# EAGLE design xbee_sdi12 (EAGLE 5.06)
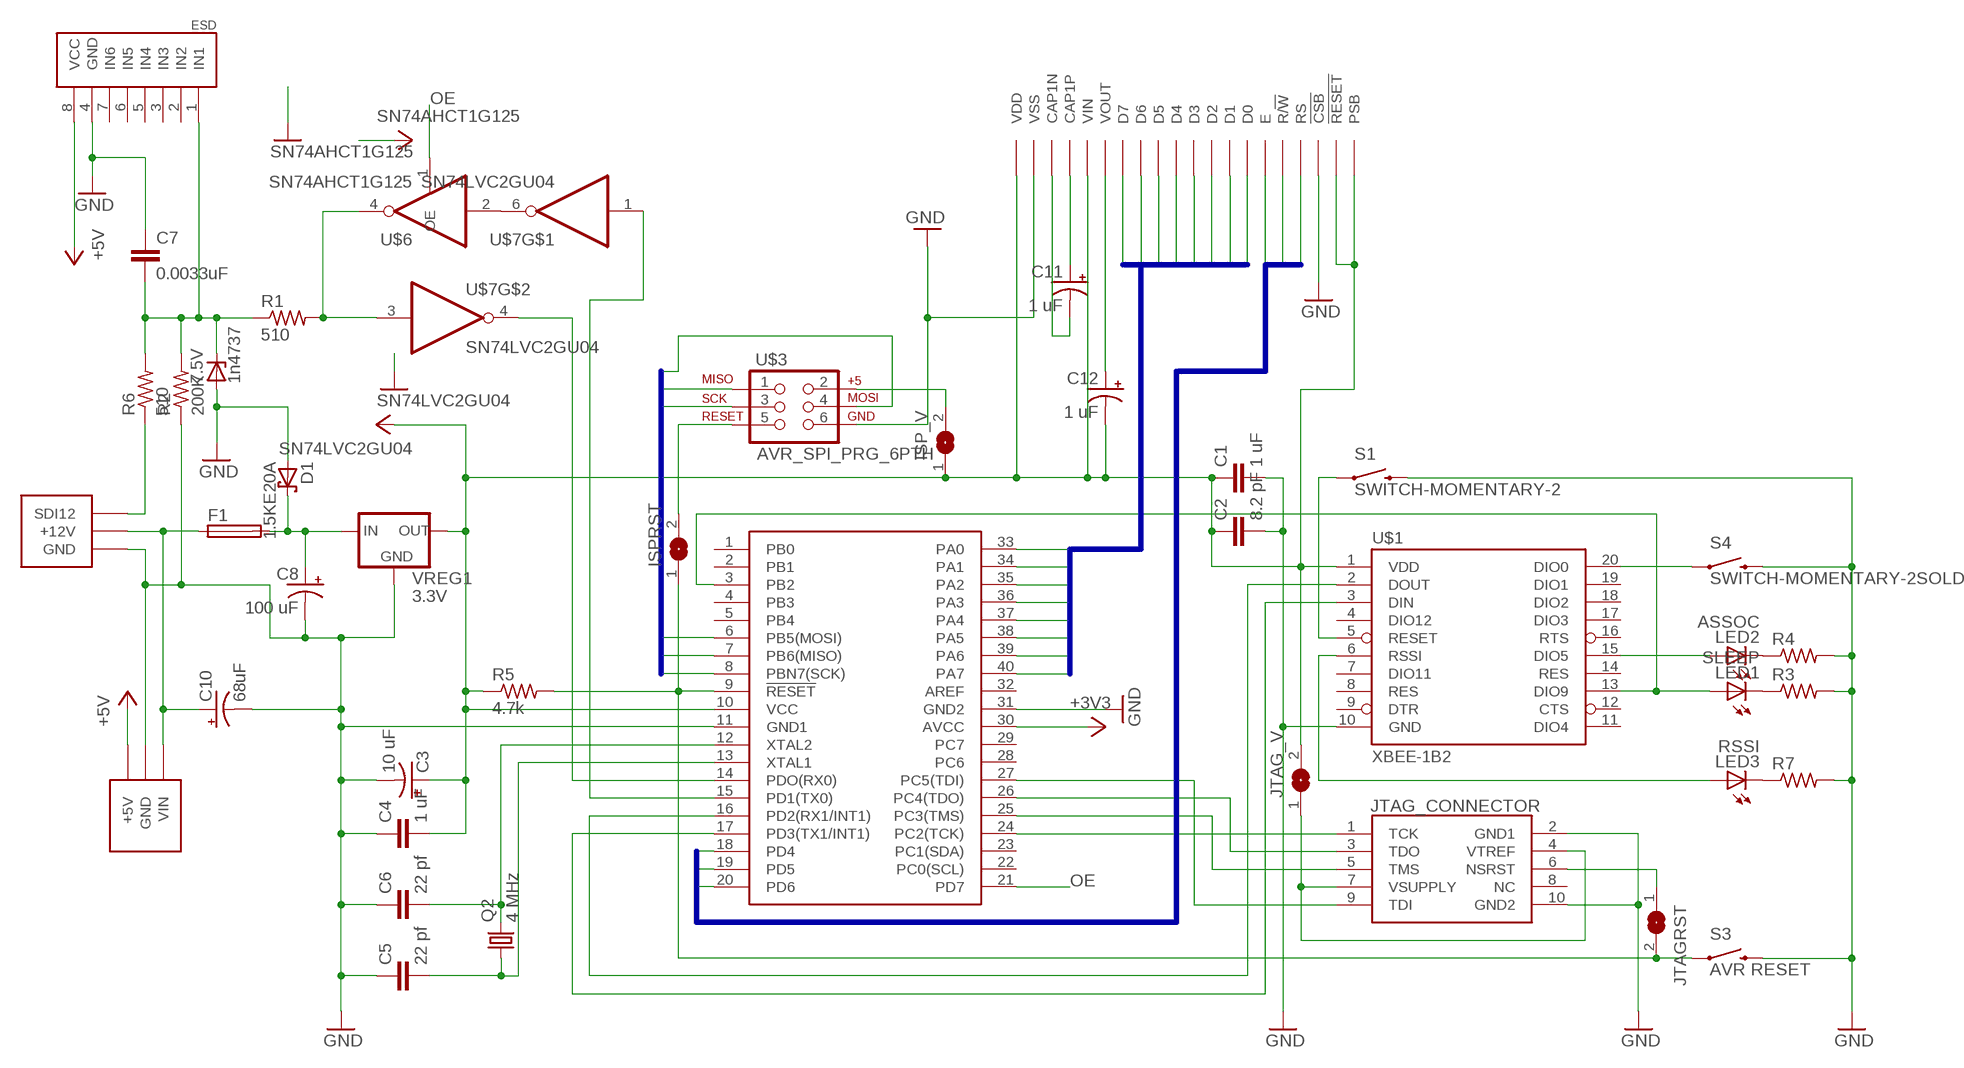
[diagram p0: schematic, sheet 1]

## Parts
2,5  SDI12  [SDI12]
7.5V  1n4737  1N4728  [DO41Z10]
C1  1 uF  CAPPTH  [CAP-PTH-SMALL]
C2  8.2 pF  CAPPTH  [CAP-PTH-SMALL]
C3  10 uF  CAP_POLPTH2  [CPOL-RADIAL-10UF-25V]
C4  1 uF  CAPPTH  [CAP-PTH-SMALL]
C5  22 pf  CAPPTH  [CAP-PTH-SMALL]
C6  22 pf  CAPPTH  [CAP-PTH-SMALL]
C7  0.0033uF  CAPPTH  [CAP-PTH-SMALL]
C8  100 uF  CAP_POLPTH2  [CPOL-RADIAL-10UF-25V]
C10  68uF  CPOL-USE3.5-8  [E3,5-8]
C11  1 uF  CAP_POLPTH2  [CPOL-RADIAL-10UF-25V]
C12  1 uF  CAP_POLPTH2  [CPOL-RADIAL-10UF-25V]
D1  1.5KE20A  15KEXXD  [DO201T15]
ESD  SP721  [DIL08]
F1  19560  [19560]
ISP_V  SJ  [SJ]
ISPRST  SJ  [SJ]
JTAG_CONNECTOR  JTAG_CONNECTOR  [2X5-SHROUDED]
JTAG_V  SJ  [SJ]
JTAGRST  SJ  [SJ]
LED1  SLEEP  LED3MM  [LED3MM]
LED2  ASSOC  LED3MM  [LED3MM]
LED3  RSSI  LED3MM  [LED3MM]
Q2  4 MHz  CRYSTALHC49US  [HC49US]
R1  510  R-US_0309/10  [0309/10]
R2  200K  R-US_0309/10  [0309/10]
R3  R-US_0309/10  [0309/10]
R4  R-US_0309/10  [0309/10]
R5  4.7k  R-US_0309/10  [0309/10]
R6  510  R-US_0309/10  [0309/10]
R7  R-US_0309/10  [0309/10]
S1  SWITCH-MOMENTARY-2  [TACTILE-PTH-RA]
S3  AVR RESET  SWITCH-MOMENTARY-2  [TACTILE-PTH-RA]
S4  SWITCH-MOMENTARY-2SOLDER  [1X02]
U$1  XBEE-1B2  [XBEE-SILK]
U$2  ATMEGA644  [DIL40]
U$3  AVR_SPI_PRG_6PTH  [2X3]
U$4  LCD  EA_LCD  [SIL40]
U$6  SN74AHCT1G125  [SOT23-5]
U$7  SN74LVC2GU04  [DBV_R-PDSO-G6]
U$8  V_REG  [TO-92]
VREG1  3.3V  3.3V_VREGNOSILKSCREEN  [TO220-PADS]

## Nets
+3V3: C1.1 C2.1 C3.1(+) C4.2 C12.2(-) ISP_V.1 JTAG_V.2 R5.1 U$1.1(VDD) U$2.10(VCC) U$2.30(AVCC) U$4.P$23(PSB) U$4.P$25(VIN) U$4.P$26(VDD) U$4.P$40(!RESET) U$7.5(+3V3) VREG1.2(OUT)
+5V: ESD.8(VCC) U$6.5(+5V) U$8.1(+5V)
GND: 2,5.GND 7.5V.A C1.2 C2.2 C3.2(-) C4.1 C5.1 C6.1 C7.1 C8.2(-) C10.- D1.A ESD.4(GND) JTAG_CONNECTOR.2(GND1) JTAG_CONNECTOR.10(GND2) R2.1 R3.2 R4.2 R7.2 S1.4 S3.4 S4.2 U$1.10(GND) U$2.11(GND1) U$2.31(GND2) U$3.6 U$4.P$27(VSS) U$4.P$38(!CSB) U$6.3(GND) U$7.2(GND) U$8.2(GND) VREG1.1(GND)
MISO: U$2.7(PB6(MISO)) U$3.1
MOSI: U$2.6(PB5(MOSI)) U$3.4
N$1: 2,5.SDI12 R6.1
N$2: C5.2 Q2.1 U$2.13(XTAL1)
N$3: U$2.15(PD1(TX0)) U$7.1(I)
N$4: JTAG_CONNECTOR.6(NSRST) JTAGRST.1
N$5: U$1.3(DIN) U$2.17(PD3(TX1/INT1))
N$6: U$1.2(DOUT) U$2.16(PD2(RX1/INT1))
N$7: U$2.14(PDO(RX0)) U$7.4(O)
N$8: C11.1(+) U$4.P$22(CAP1P)
N$9: 7.5V.C C7.2 ESD.1(IN1) R1.1 R2.2 R6.2
N$10: C6.2 Q2.2 U$2.12(XTAL2)
N$11: JTAG_CONNECTOR.1(TCK) U$2.24(PC2(TCK))
N$12: JTAG_CONNECTOR.3(TDO) U$2.26(PC4(TDO))
N$13: JTAG_CONNECTOR.5(TMS) U$2.25(PC3(TMS))
N$14: JTAG_CONNECTOR.9(TDI) U$2.27(PC5(TDI))
N$15: ISPRST.2 U$3.5
N$17: LED3.K(C) R7.1
N$18: LED1.K(C) R3.1
N$19: ISPRST.1 JTAGRST.2 R5.2 S3.3 U$2.9(!RESET)
N$20: LED1.A U$1.13(DIO9) U$2.3(PB2)
N$21: R1.2 U$6.4(O) U$7.3(I)
N$22: LED2.K(C) R4.1
N$23: LED2.A U$1.15(DIO5)
N$24: U$6.2(I) U$7.6(O)
N$25: S1.3 U$1.5(RESET)
N$26: LED3.A U$1.6(RSSI)
N$27: S4.1 U$1.20(DIO0)
N$28: C11.2(-) U$4.P$21(CAP1N)
N$29: C12.1(+) U$4.P$24(VOUT)
N$33: 2,5.12V(+12V) C10.+ F1.1 U$8.3(VIN)
N$34: JTAG_CONNECTOR.4(VTREF) JTAG_CONNECTOR.7(VSUPPLY) JTAG_V.1
N$35: ISP_V.2 U$3.2
N$36: C8.1(+) D1.C F1.2 VREG1.3(IN)
OE: U$2.21(PD7) U$6.1(OE)
PA0: U$2.33(PA0) U$4.P$35(D0)
PA1: U$2.34(PA1) U$4.P$34(D1)
PA2: U$2.35(PA2) U$4.P$33(D2)
PA3: U$2.36(PA3) U$4.P$32(D3)
PA4: U$2.37(PA4) U$4.P$31(D4)
PA5: U$2.38(PA5) U$4.P$30(D5)
PA6: U$2.39(PA6) U$4.P$29(D6)
PA7: U$2.40(PA7) U$4.P$28(D7)
PD4: U$2.18(PD4) U$4.P$36(E)
PD5: U$2.19(PD5) U$4.P$37(R/!W)
PD6: U$2.20(PD6) U$4.P$39(RS)
SCK: U$2.8(PBN7(SCK)) U$3.3
Unconnected: ESD.2(IN2) ESD.3(IN3) ESD.5(IN4) ESD.6(IN5) ESD.7(IN6) JTAG_CONNECTOR.8(NC) U$1.4(DIO12) U$1.7(DIO11) U$1.8(RES) U$1.9(DTR) U$1.11(DIO4) U$1.12(CTS) U$1.14(RES) U$1.16(RTS) U$1.17(DIO3) U$1.18(DIO2) U$1.19(DIO1) U$2.1(PB0) U$2.2(PB1) U$2.4(PB3) U$2.5(PB4) U$2.22(PC0(SCL)) U$2.23(PC1(SDA)) U$2.28(PC6) U$2.29(PC7) U$2.32(AREF)

## Buses
MOSI,MISO,SCK
PA[0..7]
PD[4..6]

## Library data of the parts
2,5 = jeff2:SDI12
7.5V = diode:1N4728: Z DIODE 3.3 V, 1W, 5 percent
C1 C2 C4-C7 = SparkFun:CAP: Capacitor Standard 0603 ceramic capacitor, and 0.1" leaded capacitor.
C3 C8 C11 C12 = SparkFun:CAP_POL: Capacitor Polarized These are standard SMD and PTH capacitors. Normally 10uF, 47uF, and 100uF in electrolytic and tantalum varieties. Always verify the external diameter of the through hole cap, it varies with capacity, voltage, and manufacturer. The EIA devices should be standard.
C10 = resistor:CPOL-US: POLARIZED CAPACITOR, American symbol
D1 = diode:15KEXXD: DIODE
ESD = jeff2:SP721
F1 = fuse:19560: FUSE HOLDER TR5, Wickmann
ISP_V ISPRST JTAG_V JTAGRST = jumper:SJ: SMD solder JUMPER
JTAG_CONNECTOR = jeff:JTAG_CONNECTOR
LED1-LED3 = led:LED: LED OSRAM: - CHIPLED LG R971, LG N971, LY N971, LG Q971, LY Q971, LO R971, LY R971 LH N974, LH R974 LS Q976, LO Q976, LY Q976 LO Q996 - Hyper CHIPLED LW Q18S LB Q993, LB Q99A, LB R99A - SideLED LS A670, LO A670, LY A670, LG A670, LP A670 LB A673, LV A673, LT A673, LW A673 LH A674 LY A675 LS A676, LA A676, LO A676, LY A676, LW A676 LS A679, LY A679, LG A679 - Hyper Micro SIDELED® LS Y876, LA Y876, LO Y876, LY Y876 LT Y87S - SmartLED LW L88C, LW L88S LB L89C, LB L89S, LG L890 LS L89K, LO L89K, LY L89K LS L896, LA L896, LO L896, LY L896 - TOPLED LS T670, LO T670, LY T670, LG T670, LP T670 LSG T670, LSP T670, LSY T670, LOP T670, LYG T670 LG T671, LOG T671, LSG T671 LB T673, LV T673, LT T673, LW T673 LH T674 LS T676, LA T676, LO T676, LY T676, LB T676, LH T676, LSB T676, LW T676 LB T67C, LV T67C, LT T67C, LS T67K, LO T67K, LY T67K, LW E67C LS E67B, LA E67B, LO E67B, LY E67B, LB E67C, LV E67C, LT E67C LW T67C LS T679, LY T679, LG T679 LS T770, LO T770, LY T770, LG T770, LP T770 LB T773, LV T773, LT T773, LW T773 LH T774 LS E675, LA E675, LY E675, LS T675 LS T776, LA T776, LO T776, LY T776, LB T776 LHGB T686 LT T68C, LB T68C - Hyper Mini TOPLED® LB M676 - Mini TOPLED Santana® LG M470 LS M47K, LO M47K, LY M47K Source: http://www.osram.convergy.de LUXEON: - LUMILED® LXK2-PW12-R00, LXK2-PW12-S00, LXK2-PW14-U00, LXK2-PW14-V00 LXK2-PM12-R00, LXK2-PM12-S00, LXK2-PM14-U00 LXK2-PE12-Q00, LXK2-PE12-R00, LXK2-PE12-S00, LXK2-PE14-T00, LXK2-PE14-U00 LXK2-PB12-K00, LXK2-PB12-L00, LXK2-PB12-M00, LXK2-PB14-N00, LXK2-PB14-P00, LXK2-PB14-Q00 LXK2-PR12-L00, LXK2-PR12-M00, LXK2-PR14-Q00, LXK2-PR14-R00 LXK2-PD12-Q00, LXK2-PD12-R00, LXK2-PD12-S00 LXK2-PH12-R00, LXK2-PH12-S00 LXK2-PL12-P00, LXK2-PL12-Q00, LXK2-PL12-R00 Source: www.luxeon.com KINGBRIGHT: KA-3528ASYC Source: www.kingbright.com
Q2 = SparkFun:CRYSTAL: Crystals Various standard crystals. Proven footprints. Spark Fun Electronics SKU : COM-00534
R1-R7 = resistor:R-US_: RESISTOR, American symbol
S1 S3 S4 = jeff2:SWITCH-MOMENTARY-2
U$1 = SparkFun:XBEE-1
U$2 = jeff:ATMEGA644
U$3 = SparkFun:AVR_SPI_PRG_6: AVR ISP 6 Pin This is the reduced ISP connector for AVR programming. Common on Arduino. This footprint will take up less PCB space and can be used with a 10-pin to 6-pin adapter such as SKU: BOB-08508
U$4 = jeff2:EA_LCD
U$6 = jeff:SN74AHCT1G125
U$7 = jeff:SN74LVC2GU04
U$8 = jeff2:V_REG
VREG1 = jeff2:3.3V_VREG

## Board
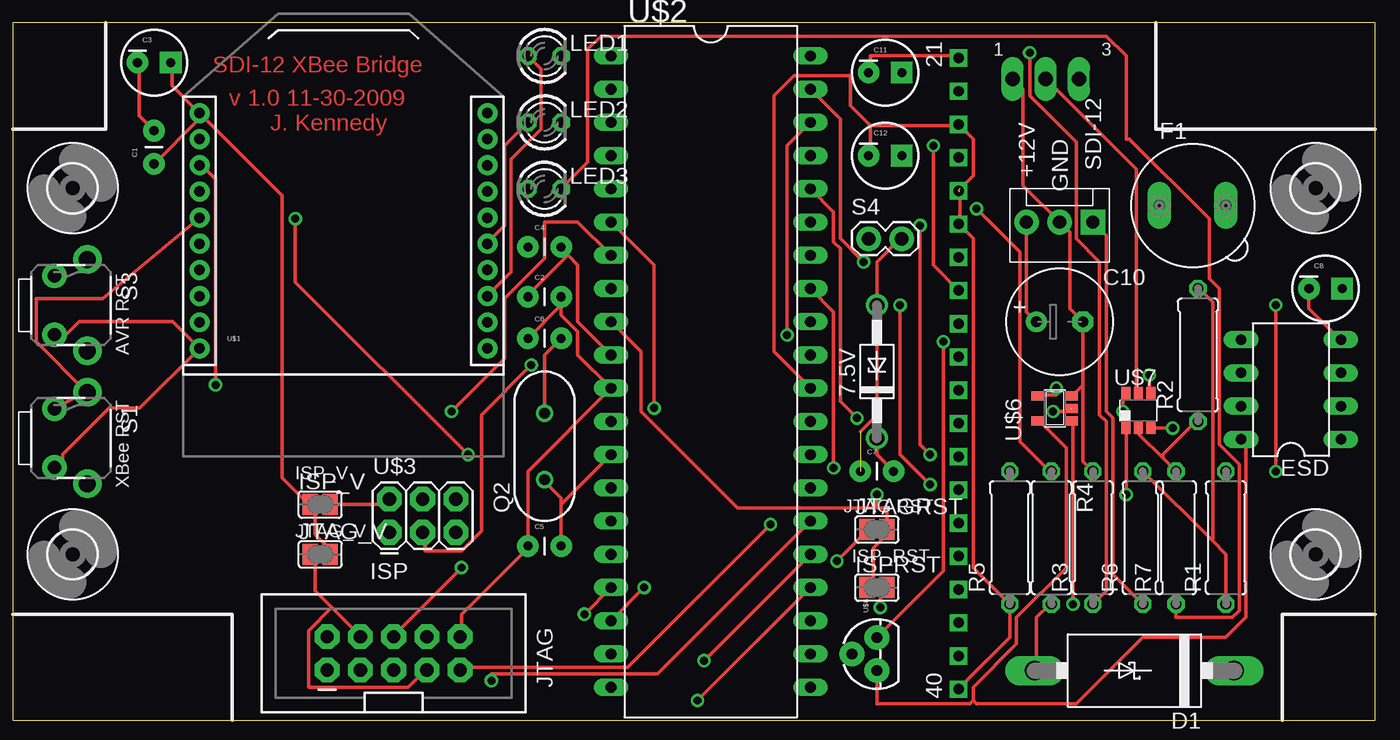
[diagram p1: board, top side]
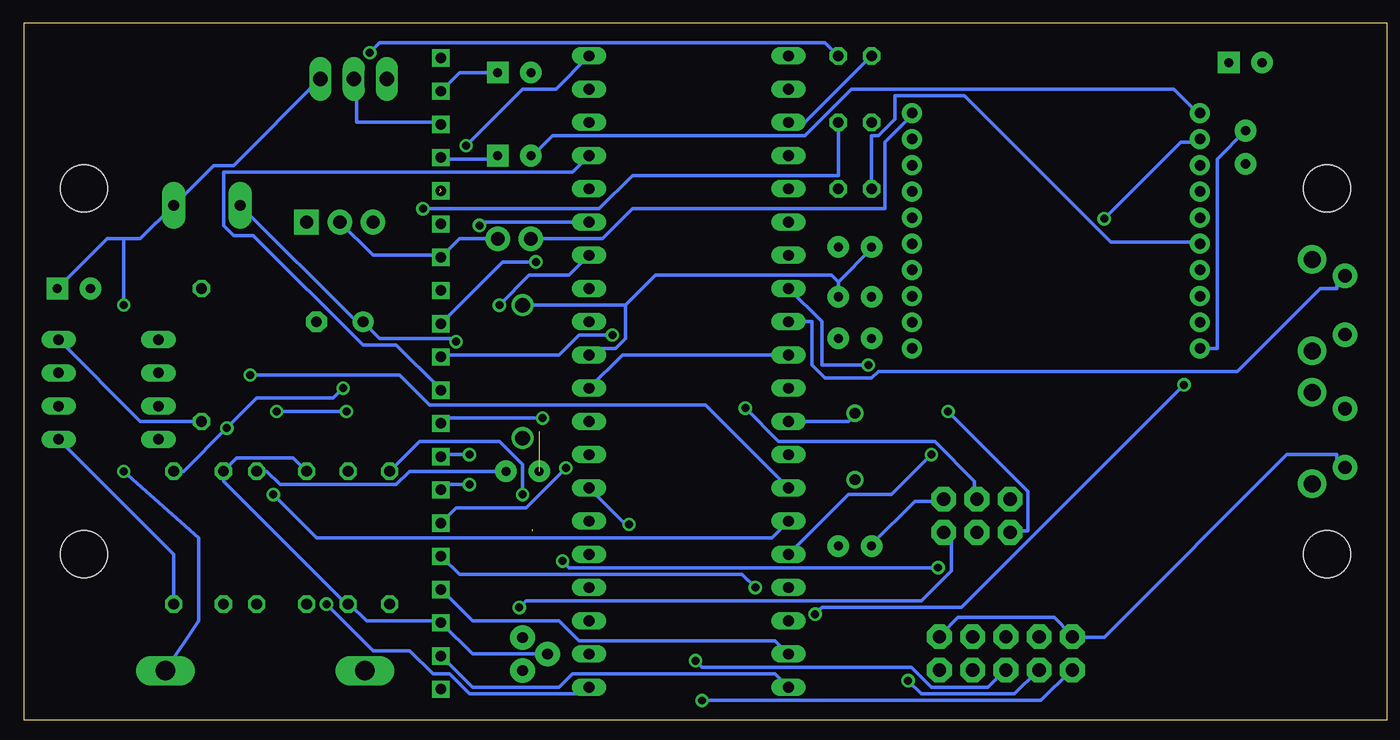
[diagram p2: board, bottom side, seen from below]

No outline drawn. Coordinates in mm, seen from the top.
Copper layers (1*16): Top 0.035mm / dielectric 1.5mm / Bottom 0.035mm
Design rules "default": minimum track width 10mil, minimum drill 24mil, track to track 8mil, track to pad 8mil, pad to pad 8mil, via to via 8mil, smd to smd 8mil, copper to edge 40mil, drill to drill 8mil, minimum pad ring 10mil, minimum via ring 8mil, stop-mask expansion 4mil, vias tented up to drill 0mil, thermal gap 10mil
tRestrict: area 0,45.7 to 6.3,53.3; area 87.6,45.7 to 104.1,53.3; area 97.8,0 to 104.1,7.6; area 0,0 to 16.5,7.6; area 10.2,10.2 to 20.3,19.1
Milling: 4 lines

### Footprints (pad centres in the part's own frame; a part is rotated, then mirrored left to right if it is on the bottom)
3,6 = hole 3.6: 0,0
SDI12 = drill 1.016 pad 1.88 round: 12V 5.08,0; GND 2.54,0 | drill 1.016 pad 1.88 square: SDI12 0,0
DO41Z10 = drill 1.118 round: A 5.08,0; C -5.08,0
CAP-PTH-SMALL = drill 0.7 pad 1.651 round: 1 0,0; 2 2.54,0
CPOL-RADIAL-10UF-25V = drill 0.7 pad 1.651 square: 1 1.27,0 | drill 0.7 pad 1.651 round: 2 -1.27,0
E3,5-8 = drill 0.813 pad 1.6 round: + -1.778,0 | drill 0.813 pad 1.6 octagon: - 1.778,0
DO201T15 = drill 1.499 long: A 7.62,0; C -7.62,0
DIL08 = drill 0.813 long: 1 -3.81,-3.81; 2 -1.27,-3.81; 3 1.27,-3.81; 4 3.81,-3.81; 5 3.81,3.81; 6 1.27,3.81; 7 -1.27,3.81; 8 -3.81,3.81
19560 = drill 0.813 pad 1.778 long: 1 -2.54,0; 2 2.54,0
SJ = smd 1.168 x 1.6: 1 -0.762,0; 2 0.762,0
2X5-SHROUDED = drill 1.016 pad 1.88 octagon: 1 -1.27,5.08; 2 1.27,5.08; 3 -1.27,2.54; 4 1.27,2.54; 5 -1.27,0; 6 1.27,0; 7 -1.27,-2.54; 8 1.27,-2.54; 9 -1.27,-5.08; 10 1.27,-5.08
LED3MM = drill 0.813 octagon: A -1.27,0; K 1.27,0
HC49US = drill 0.813 round: 1 -2.54,0; 2 2.54,0
0309/10 = drill 0.813 octagon: 1 -5.08,0; 2 5.08,0
TACTILE-PTH-RA = drill 1.3 pad 2.184 round: 1 -3.5,1.25; 2 3.5,1.25 | drill 1.016 pad 1.88 round: 3 -2.25,-1.25; 4 2.25,-1.25
1X02 = drill 1.016 pad 1.88 round: 1 0,0; 2 2.54,0
XBEE-SILK = drill 0.8 pad 1.524 round: 1 -11,20; 2 -11,18; 3 -11,16; 4 -11,14; 5 -11,12; 6 -11,10; 7 -11,8; 8 -11,6; 9 -11,4; 10 -11,2; 11 11,2; 12 11,4; 13 11,6; 14 11,8; 15 11,10; 16 11,12; 17 11,14; 18 11,16; 19 11,18; 20 11,20
DIL40 = drill 0.813 long: 1 -24.13,-7.62; 2 -21.59,-7.62; 3 -19.05,-7.62; 4 -16.51,-7.62; 5 -13.97,-7.62; 6 -11.43,-7.62; 7 -8.89,-7.62; 8 -6.35,-7.62; 9 -3.81,-7.62; 10 -1.27,-7.62; 11 1.27,-7.62; 12 3.81,-7.62; 13 6.35,-7.62; 14 8.89,-7.62; 15 11.43,-7.62; 16 13.97,-7.62; 17 16.51,-7.62; 18 19.05,-7.62; 19 21.59,-7.62; 20 24.13,-7.62; 21 24.13,7.62; 22 21.59,7.62; 23 19.05,7.62; 24 16.51,7.62; 25 13.97,7.62; 26 11.43,7.62; 27 8.89,7.62; 28 6.35,7.62; 29 3.81,7.62; 30 1.27,7.62; 31 -1.27,7.62; 32 -3.81,7.62; 33 -6.35,7.62; 34 -8.89,7.62; 35 -11.43,7.62; 36 -13.97,7.62; 37 -16.51,7.62; 38 -19.05,7.62; 39 -21.59,7.62; 40 -24.13,7.62
2X3 = drill 1.016 pad 1.88 octagon: 1 0,0; 2 0,2.54; 3 2.54,0; 4 2.54,2.54; 5 5.08,0; 6 5.08,2.54
SIL40 = drill 0.8 square: P$21 -24.13,0; P$22 -21.59,0; P$23 -19.05,0; P$24 -16.51,0; P$25 -13.97,0; P$26 -11.43,0; P$27 -8.89,0; P$28 -6.35,0; P$29 -3.81,0; P$30 -1.27,0; P$31 1.27,0; P$32 3.81,0; P$33 6.35,0; P$34 8.89,0; P$35 11.43,0; P$36 13.97,0; P$37 16.51,0; P$38 19.05,0; P$39 21.59,0; P$40 24.13,0
SOT23-5 = smd 0.69 x 0.99: 1 -0.95,-1.29; 2 0,-1.29; 3 0.95,-1.29; 4 0.95,1.3; 5 -0.95,1.3
DBV_R-PDSO-G6 = smd 0.69 x 0.99: 1 -0.95,-1.29; 2 0,-1.29; 3 0.95,-1.29; 4 0.95,1.3; 5 0,1.3; 6 -0.95,1.3
TO-92 = drill 0.813 pad 1.88 round: 1 -1.27,0; 2 0,1.905; 3 1.27,0
TO220-PADS = drill 1.118 long: 1 -2.54,0; 2 0,0; 3 2.54,0

### Placement (x,y rotation side)
2,1  [3,6]  4.57,12.7 0 top
2,2  [3,6]  4.57,40.69 0 top
2,3  [3,6]  99.57,12.7 0 top
2,4  [3,6]  99.57,40.69 0 top
2,5  82.55,38.1 180 top
7.5V  66.04,26.67 90 top
C1  10.79,42.55 90 top
C2  39.37,32.38 0 top
C3  10.79,50.29 0 top
C4  39.37,36.2 0 top
C5  39.37,13.34 0 top
C6  39.37,29.21 0 top
C7  64.77,19.05 0 top
C8  100.33,33.02 0 top
C10  80.01,30.48 0 top
C11  66.67,49.53 0 top
C12  66.67,43.18 0 top
D1  85.72,3.81 180 top
ESD  97.69,25.3 90 top
F1  90.17,39.37 0 top
ISP_V  23.5,16.51 0 top
ISPRST  66.04,10.16 0 top
JTAG_CONNECTOR  29.11,5.13 90 top
JTAG_V  23.5,12.7 0 top
JTAGRST  66.04,14.61 0 top
LED1  40.64,50.8 0 top
LED2  40.64,45.72 0 top
LED3  40.64,40.64 0 top
Q2  40.64,20.95 90 top
R1  92.71,13.97 90 top
R2  90.58,27.94 90 top
R3  82.55,13.97 90 top
R4  79.38,13.97 270 top
R5  76.2,13.97 90 top
R6  86.36,13.97 90 top
R7  88.9,13.97 90 top
S1  4.45,21.59 270 top
S3  4.45,31.75 270 top
S4  65.41,36.83 0 top
U$1  25.27,26.44 0 top
U$2  53.34,26.67 270 top
U$3  28.78,14.38 0 top
U$4  72.29,26.52 270 top
U$6  79.63,23.85 90 top
U$7  86.03,23.7 0 top
U$8  66.04,5.08 90 top
VREG1  78.95,49.04 0 top

### Tracks (layer width: path | path; a pad name or v marks a point on that pad's centre or on a via)
+3V3  (2 unrouted)
  Top 0.254: JTAG_V.2 24.13,12.7 24.13,13.21 23.11,14.22 23.11,16.26 22.86,16.51 ISP_V.1 22.61,16.51 20.57,18.54 20.57,40.13 14.48,46.23 U$1.1 | U$1.1 14.22,46.48 12.19,48.51 12.19,50.29 C3.1 | C1.1 14.22,45.97 14.22,46.23 U$1.1 | U$2.10 43.18,30.48 43.18,34.8 42.42,35.56 | 42.42,35.56 41.91,36.07 C4.2 42.42,35.56 | 42.42,35.56 39.37,32.51 C2.1 | U$7.5 85.85,25.15 85.85,42.16 78.99,49.02 VREG1.2 | U$4.P$40 72.39,2.54 76.2,6.35 R5.1 73.41,11.68 73.41,36.83 U$4.P$26 72.39,38.1 72.39,40.39 | 65.53,45.47 72.14,45.47 U$4.P$23 73.41,44.45 73.41,41.66 72.39,40.64 | 65.53,45.47 65.53,43.18 C12.2 | U$2.30 58.17,28.19 58.17,47.75 59.69,49.28 64.01,49.28 64.01,46.99 65.53,45.47
  Bottom 0.254: U$2.30 58.42,27.94 U$2.10 | VREG1.2 78.74,49.02 78.74,45.72 72.39,45.72 U$4.P$23 | U$1.1 14.48,46.48 16.26,48.26 40.89,48.26 44.45,44.7 63.75,44.7 65.28,43.18 C12.2
+5V
  Top 0.254: 73.41,1.52 73.41,2.54 76.71,5.84 76.71,7.87 80.52,11.68 80.52,20.83 78.49,22.86 U$6.5 | 73.41,1.52 73.15,1.27 66.04,1.27 U$8.1 | ESD.8 93.98,21.34 94.23,21.08 94.23,7.87 92.71,6.35 86.36,6.35 81.28,1.27 73.66,1.27 73.41,1.52
GND  (1 unrouted)
  Top 0.254: C1.2 9.65,46.23 9.65,50.29 C3.2 | U$1.10 14.22,28.45 | 41.91,31.75 41.91,30.99 43.18,29.72 43.18,27.94 U$2.11 39.37,19.05 C5.1 39.37,13.21 34.29,8.13 34.29,6.6 JTAG_CONNECTOR.10 | 41.91,31.75 C6.1 | 41.91,31.75 C2.2 | VREG1.1 76.45,49.02 77.22,48.26 77.22,40.89 2,5.GND 80.77,37.34 80.77,31.5 C10.- 81.79,25.65 | 64.77,22.1 66.04,23.37 7.5V.A 66.04,35.05 67.82,36.83 S4.2 | R4.2 79.25,8.89 78.23,7.87 78.23,3.81 D1.A | C8.2 99.06,31.5 101.35,29.21 ESD.4 | R7.2 87.88,20.07 | 87.88,20.07 86.11,21.84 86.11,22.35 U$7.2 | 87.88,20.07 87.88,20.32 90.42,22.86 R2.1 | 81.79,25.65 81.03,24.89 U$6.3 | R3.2 81.79,19.81 81.79,25.65 | S1.4 3.81,19.95 3.81,20.32 7.37,23.88 9.71,23.88 U$1.10 | S3.4 4.1,29.5 5.08,30.48 12.23,30.48 U$1.10
  Bottom 0.254: C1.2 12.95,42.93 12.95,28.45 14.22,28.45 U$1.10 | 41.91,33.53 39.37,36.07 C4.1 | C2.2 41.91,33.53 | C5.1 39.37,13.46 36.07,16.76 34.04,16.76 U$3.6 | JTAG_CONNECTOR.2 24.13,6.6 25.4,7.87 32.77,7.87 34.04,6.6 JTAG_CONNECTOR.10 | JTAG_CONNECTOR.2 23.88,6.6 | S4.2 70.87,36.83 U$4.P$27 72.39,35.56 77.47,35.56 2,5.GND | U$2.31 60.45,28.45 58.93,28.45 58.17,29.21 58.17,31.75 | 58.17,31.75 7.5V.A | U$8.2 69.85,5.08 72.14,7.37 U$4.P$38 72.39,7.62 77.98,7.62 79.25,8.89 R4.2 79.5,8.89 88.9,18.29 R7.2 87.88,20.07 83.57,20.07 R3.2 | ESD.4 95.25,22.86 R2.1 | 41.91,33.53 42.42,34.04 55.88,34.04 58.17,31.75 | JTAG_CONNECTOR.2 23.98,6.35 21.59,6.35 7.62,20.32 3.81,20.32 3.81,19.95 S1.4
MISO  (via drill 0.61)
  Top 0.254: U$2.7 43.18,38.1 40.64,38.1 40.64,35.31 37.59,32.26 37.59,27.69 v33.53,23.62
  Bottom 0.254: v33.53,23.62 27.43,17.53 27.43,14.48 28.7,14.48 U$3.1
MOSI  (via drill 0.61)
  Top 0.254: U$2.6 49.02,34.8 v49.02,23.88
  Bottom 0.254: v49.02,23.88 46.48,21.34 34.54,21.34 31.5,18.29 31.5,17.02 U$3.4
N$1
  Top 0.254: R6.1 84.07,11.18 84.07,23.11 83.57,23.62 83.57,37.08 2,5.SDI12
N$2
  Top 0.254: 41.91,16.51 41.91,17.02 40.64,18.29 Q2.1 | C5.2 41.91,16.51 | 41.91,16.51 U$2.13
N$3  (via drill 0.61)
  Top 0.254: v85.09,17.27 85.09,22.35 U$7.1
  Bottom 0.254: v85.09,17.27 81.79,13.97 46.99,13.97 U$2.15
N$4  (via drill 0.61)  (1 unrouted)
  Top 0.254: v62.99,12.19 65.28,14.48 | v34.29,11.68 29.21,6.6 JTAG_CONNECTOR.6
  Bottom 0.254: v62.99,12.19 62.48,11.68 v34.29,11.68
N$5  (via drill 0.61)
  Top 0.254: v43.69,8.13 U$2.17 | v15.49,25.65 15.49,41.4 14.48,42.42 U$1.3
  Bottom 0.254: v43.69,8.13 43.18,8.64 32.51,8.64 v15.49,25.65
N$6  (via drill 0.61)
  Top 0.254: v34.8,20.32 21.59,33.53 v21.59,38.35
  Bottom 0.254: U$2.16 41.15,17.27 37.85,17.27 v34.8,20.32 | v21.59,38.35 15.75,44.2 14.48,44.2 U$1.2
N$7  (via drill 0.61)
  Top 0.254: v86.87,26.42 86.87,25.15 U$7.4
  Bottom 0.254: v86.87,26.42 75.44,26.42 73.15,24.13 52.07,24.13 U$2.14
N$8
  Bottom 0.254: U$4.P$22 70.87,49.53 C11.1
N$9
  Top 0.254: C7.2 66.04,20.32 7.5V.C | 91.69,13.72 92.71,12.7 R1.1 | R6.2 91.69,13.72 | 91.69,13.72 91.69,32 90.68,33.02 R2.2
  Bottom 0.254: R1.1 92.71,12.7 ESD.1 | C7.2 74.68,19.05 75.69,18.03 84.58,18.03 85.6,19.05 R6.2
N$10
  Top 0.254: C6.2 40.64,27.94 Q2.2
  Bottom 0.254: U$2.12 41.15,22.86 40.64,23.37 Q2.2
N$11  (via drill 0.61)
  Top 0.254: v52.32,1.52 U$2.24
  Bottom 0.254: v52.32,1.52 26.42,1.52 24.13,3.81 JTAG_CONNECTOR.1
N$12  (via drill 0.61)
  Top 0.254: U$2.26 49.28,3.56 36.58,3.56 v36.58,3.05
  Bottom 0.254: v36.58,3.05 35.56,2.03 28.45,2.03 26.67,3.81 JTAG_CONNECTOR.3
N$13  (via drill 0.61)
  Top 0.254: v52.83,4.57 U$2.25
  Bottom 0.254: v52.83,4.57 52.32,4.06 36.32,4.06 34.8,2.54 30.48,2.54 29.21,3.81 JTAG_CONNECTOR.5
N$14  (via drill 0.61)
  Top 0.254: v57.91,14.99 46.99,4.06 34.29,4.06 JTAG_CONNECTOR.9
  Bottom 0.254: U$2.27 58.17,14.99 v57.91,14.99
N$15  (via drill 0.61)
  Top 0.254: ISPRST.2 66.29,9.65 v66.29,8.64
  Bottom 0.254: v66.29,8.64 65.79,9.14 35.56,9.14 33.27,11.43 33.27,14.22 33.78,14.22 U$3.5
N$17
  Top 0.254: LED3.K 43.94,42.67 43.94,51.31 44.96,52.32 83.57,52.32 85.09,50.8 85.09,44.45 85.34,44.45 91.44,38.35 91.44,33.78 92.2,33.02 92.2,21.08 93.73,19.56 93.73,8.38 93.22,7.87 88.9,7.87 R7.1
N$18  (via drill 0.61)
  Top 0.254: R3.1 83.57,9.91 83.57,22.86 83.06,23.37 83.06,35.05 81.28,36.83 81.28,44.2 77.72,47.75 v77.72,51.05
  Bottom 0.254: v77.72,51.05 76.96,51.82 42.93,51.82 LED1.K
N$19  (via drill 0.61)
  Top 0.254: ISPRST.1 65.79,10.67 65.79,13.21 66.8,14.22 JTAGRST.2 66.8,16.26 66.04,16.26 | U$2.9 48.01,28.19 48.01,23.62 55.37,16.26 66.04,16.26 | 66.04,16.26 v66.04,17.27
  Bottom 0.254: R5.2 73.91,21.34 67.82,21.34 66.04,19.56 v66.04,17.27 | U$2.9 43.94,30.48 43.94,27.18 42.93,26.16 39.37,26.16 38.86,26.67 11.43,26.67 5.08,33.02 3.81,33.02 3.81,33.38 S3.3
N$20
  Top 0.254: LED1.A 40.39,49.78 40.39,45.21 38.1,42.93 38.1,34.29 36.32,32.51 U$1.13
  Bottom 0.254: LED1.A 44.45,45.72 U$2.3
N$21  (via drill 0.61)
  Top 0.254: v88.65,22.35 87.12,22.35 U$7.3 | v79.76,25.4 79.76,24.89 78.49,24.89 U$6.4
  Bottom 0.254: R1.2 91.95,19.05 v88.65,22.35 86.36,24.64 80.52,24.64 v79.76,25.4
N$22  (via drill 0.61)
  Top 0.254: v73.66,39.12 76.96,35.81 76.96,21.34 79.25,19.05 R4.1
  Bottom 0.254: LED2.K 41.91,41.66 57.66,41.66 60.2,39.12 v73.66,39.12
N$23
  Top 0.254: LED2.A 37.59,43.94 37.59,37.85 36.32,36.58 U$1.15
N$24  (via drill 0.61)
  Top 0.254: v79.5,23.62 80.77,23.62 U$6.2 | v84.84,23.62 84.84,24.89 U$7.6
  Bottom 0.254: v79.5,23.62 v84.84,23.62
N$25
  Top 0.254: U$1.5 14.22,38.35 6.86,32.26 1.78,32.26 1.78,28.96 5.59,25.15 S1.3
N$26
  Bottom 0.254: LED3.A 39.37,44.7 38.86,44.7 37.59,45.97 37.59,47.75 32.26,47.75 21.08,36.58 14.48,36.58 U$1.6
N$27
  Bottom 0.254: U$1.20 36.32,46.23 38.35,44.2 38.35,39.12 57.66,39.12 59.94,36.83 S4.1
N$28
  Top 0.254: U$4.P$21 72.14,50.8 65.53,50.8 65.53,49.53 C11.2
N$29
  Bottom 0.254: U$4.P$24 72.14,42.93 68.33,42.93 68.07,43.18 C12.1
N$33  (via drill 0.61)
  Top 0.254: C10.+ 77.47,31.24 2,5.12V | U$8.3 71.12,11.43 v71.12,28.96
  Bottom 0.254: F1.1 78.74,30.48 C10.+ 76.96,29.21 71.37,29.21 v71.12,28.96
N$34
  Top 0.254: 24.38,8.64 26.42,6.6 JTAG_CONNECTOR.4 | 24.38,8.64 23.11,9.91 23.11,12.45 22.86,12.7 JTAG_V.1 | 24.38,8.64 22.61,6.86 22.61,2.54 30.23,2.54 31.5,3.81 JTAG_CONNECTOR.7
N$35
  Top 0.254: ISP_V.2 28.7,16.51 28.7,16.76 U$3.2
N$36  (via drill 0.6)
  Top 0.254: v96.52,19.05 v96.52,31.75
  Bottom 0.254: 96.52,36.83 95.25,36.83 F1.2 89.66,42.42 88.14,42.42 81.53,49.02 VREG1.3 | 93.47,3.81 D1.C 90.81,7.62 90.81,13.97 v96.52,19.05 | C8.1 97.79,36.83 96.52,36.83 | v96.52,31.75 96.52,36.83
OE  (via drill 0.61)
  Top 0.254: v81.03,8.89 81.03,22.86 U$6.1
  Bottom 0.254: v81.03,8.89 77.47,5.33 74.68,5.33 72.9,3.56 71.63,3.56 70.1,2.03 61.47,2.03 U$2.21
PA0  (via drill 0.61)
  Top 0.254: v62.74,19.3 62.74,31.24 U$2.33
  Bottom 0.254: v62.74,19.3 65.79,16.26 71.12,16.26 U$4.P$35
PA1  (via drill 0.61)
  Top 0.254: v70.1,18.03 67.82,20.32 v67.82,31.75
  Bottom 0.254: v70.1,18.03 71.88,18.03 U$4.P$34 | v67.82,31.75 65.53,34.04 62.48,34.04 U$2.34
PA2  (via drill 0.61)
  Top 0.254: v70.1,20.32 69.34,21.08 v69.34,37.85
  Bottom 0.254: v70.1,20.32 72.14,20.32 U$4.P$33 | v69.34,37.85 69.09,38.1 U$2.35
PA3  (via drill 0.61)
  Top 0.254: v64.52,23.11 63.25,24.38 63.25,36.07 62.74,36.58 62.74,38.86 U$2.36
  Bottom 0.254: v64.52,23.11 71.88,23.11 U$4.P$32
PA4
  Bottom 0.254: U$2.37 62.23,41.91 88.9,41.91 88.9,37.85 88.14,37.08 86.61,37.08 78.23,28.7 75.69,28.7 72.39,25.4 U$4.P$31
PA5  (via drill 0.61)
  Top 0.254: v59.18,29.46 59.18,43.94 U$2.38
  Bottom 0.254: v59.18,29.46 61.72,29.46 63.25,27.94 72.14,27.94 U$4.P$30
PA6  (via drill 0.61)
  Top 0.254: v65.02,35.05 63.25,36.83 63.25,45.97 U$2.39
  Bottom 0.254: v65.02,35.05 67.56,35.05 U$4.P$29
PA7  (via drill 0.61)
  Top 0.254: v70.36,43.94 70.36,34.8 U$4.P$28
  Bottom 0.254: v70.36,43.94 66.04,48.26 63.5,48.26 U$2.40
PD4  (via drill 0.61)
  Top 0.254: U$2.18 v48.26,10.16
  Bottom 0.254: v48.26,10.16 49.28,11.18 70.87,11.18 72.14,12.45 U$4.P$36
PD5
  Bottom 0.254: U$2.19 46.74,6.1 61.72,6.1 63.25,7.62 69.85,7.62 72.14,9.91 U$4.P$37
PD6
  Bottom 0.254: U$2.20 46.74,3.56 62.23,3.56 63.25,2.54 69.85,2.54 72.14,4.83 U$4.P$39
SCK  (via drill 0.61)
  Top 0.254: v39.62,27.18 35.81,23.37 35.81,14.48 34.29,12.95 31.5,12.95 31.5,14.22 U$3.3
  Bottom 0.254: U$2.8 43.18,30.48 43.18,27.18 v39.62,27.18

### Text on the board
Top: SDI-12 XBee Bridge | v 1.0 11-30-2009 | J. Kennedy
tPlace: 1 | 3 | AVR RST | XBee RST | ISP_V | JTAG RST | JTAG_V | ISP_RST | ISP | JTAG